# Altium schematic sheet N76E003.SchDoc
size A4
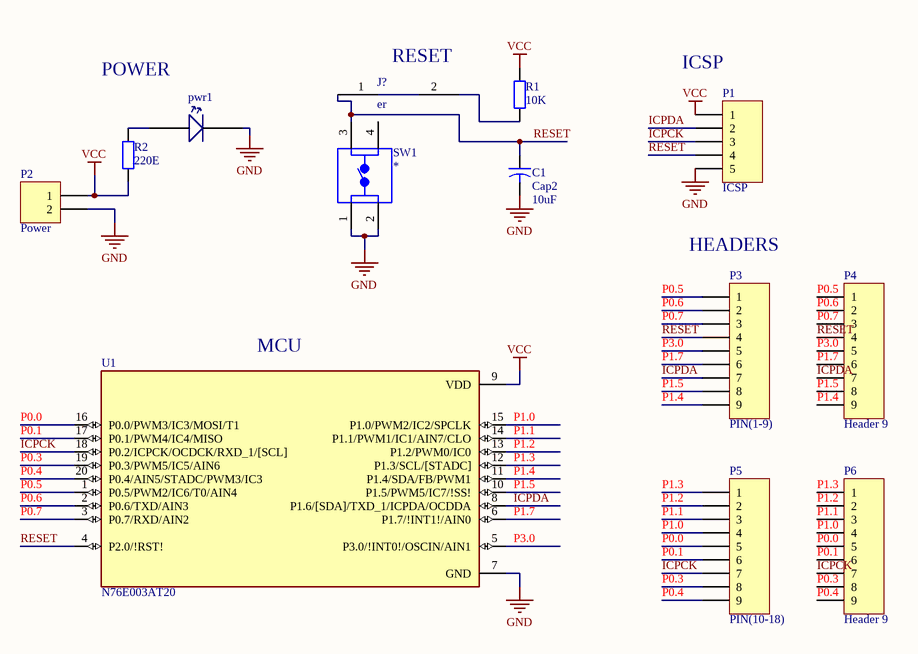
[diagram p0: N76E003.SchDoc]

## Parts
C1  Cap2  value 10uF  [CAPR5-4X5]
J?  er  [jumper]
P1  ICSP  [HDR1X5]
P2  Power  [HDR1X2]
P3  PIN(1-9)  [HDR1X9]
P4  Header 9  [HDR1X9]
P5  PIN(10-18)  [HDR1X9]
P6  Header 9  [HDR1X9]
pwr1  3mm  [3mm]  (value not drawn)
R1  value 10K  [AXIAL-0.4]  (hidden comment: Res2)
R2  value 220E  [AXIAL-0.4]  (hidden comment: Res2)
SW1  3-1825910-1  [TE_3-1825910-1]  (value not drawn)
U1  N76E003AT20  [SOP65P640X120-20N]

## Nets
GND: C1.2 P1.5 P2.2 pwr1.2 SW1.1 SW1.2 U1.7(GND)
VCC: P1.1 P2.1 R1.2 R2.1 U1.9(VDD)
ICPCK: P1.3 P5.7 P6.7 U1.18(P0.2/ICPCK/OCDCK/RXD_1/[SCL])
ICPDA: P1.2 P3.7 P4.7 U1.8(P1.6/[SDA]/TXD_1/ICPDA/OCDDA)
P0.0: P5.5 P6.5 U1.16(P0.0/PWM3/IC3/MOSI/T1)
P0.1: P5.6 P6.6 U1.17(P0.1/PWM4/IC4/MISO)
P0.3: P5.8 P6.8 U1.19(P0.3/PWM5/IC5/AIN6)
P0.4: P5.9 P6.9 U1.20(P0.4/AIN5/STADC/PWM3/IC3)
P0.5: P3.1 P4.1 U1.1(P0.5/PWM2/IC6/T0/AIN4)
P0.6: P3.2 P4.2 U1.2(P0.6/TXD/AIN3)
P0.7: P3.3 P4.3 U1.3(P0.7/RXD/AIN2)
P1.0: P5.4 P6.4 U1.15(P1.0/PWM2/IC2/SPCLK)
P1.1: P5.3 P6.3 U1.14(P1.1/PWM1/IC1/AIN7/CLO)
P1.2: P5.2 P6.2 U1.13(P1.2/PWM0/IC0)
P1.3: P5.1 P6.1 U1.12(P1.3/SCL/[STADC])
P1.4: P3.9 P4.9 U1.11(P1.4/SDA/FB/PWM1)
P1.5: P3.8 P4.8 U1.10(P1.5/PWM5/IC7/!SS!)
P1.7: P3.6 P4.6 U1.6(P1.7/!INT1!/AIN0)
P3.0: P3.5 P4.5 U1.5(P3.0/!INT0!/OSCIN/AIN1)
RESET: C1.1 J?.1 P1.4 P3.4 P4.4 SW1.3 U1.4(P2.0/!RST!)
NetJ?_2: J?.2 R1.1
Netpwr1_1: pwr1.1 R2.2

Not connected (* = marked no-connect by the designer): SW1 4

## Notes on the sheet
- POWER
- (near J?) RESET
- (near P1) ICSP
- (near P3) HEADERS
- (near U1) MCU

## Library data of the parts
C1 = Cap2: Capacitor; Published: 23-Sep-2002; PackageReference: CAPR5-4X5; Publisher: Altium Limited
J? = jumper
P1 = Header 5: Header, 5-Pin; LatestRevisionDate: 17-Jul-2002; LatestRevisionNote: Re-released for DXP Platform.; Publisher: Altium Limited
P2 = Header 2: Header, 2-Pin; LatestRevisionDate: 17-Jul-2002; LatestRevisionNote: Re-released for DXP Platform.; Publisher: Altium Limited
P3-P6 = Header 9: Header, 9-Pin; LatestRevisionDate: 17-Jul-2002; LatestRevisionNote: Re-released for DXP Platform.; Publisher: Altium Limited
R1 R2 = Res2: Resistor; Published: 8-Jun-2000; LatestRevisionDate: 17-Jul-2002; LatestRevisionNote: Re-released for DXP Platform.; PackageReference: AXIAL-0.4; Publisher: Altium Limited
SW1 = 3-1825910-1: Switch Push Button OFF _ON_ SPST Round Button 0.05A 24VDC Momentary Contact PC Pins Thru-Hole; MF: TE Connectivity; Availability: Unavailable; SnapEDA_Link: https://www.snapeda.com/parts/3-1825910-1/TE%20Connectivity%20ALCOSWITCH%20Switches/view-part/452461/?ref=snap; Price: None; EU_RoHS_Compliance: Compliant; Package: None; TE_purchase_URL: https://www.te.com/usa-en/product-3-1825910-1.html?te_bu=Cor&te_type=disp&te_campaign=seda_glo_cor-seda-global-disp-prtnr-fy19-seda-model-bom-cta_sma-317_1&elqCampaignId=32493; MP: 3-1825910-1; Value: *; Comment_1: *
U1 = N76E003AT20: 8051 N76 Microcontroller IC 8-Bit 16MHz 18KB _18K x 8_ FLASH 20-TSSOP; MF: Nuvoton Technology; Availability: Unavailable; MP: N76E003AT20; Package: TSSOP-20 Nuvoton Technology; SnapEDA_Link: https://www.snapeda.com/parts/N76E003AT20/Nuvoton%20Technology%20Corporation%20of%20America/view-part/652314/?ref=snap; Value: *; Price: None